# Altium schematic sheet HALF_BRIDGE_DRIVER.SchDoc
size 420 x 297 mm; SheetNumber: 22; SheetTotal: 27
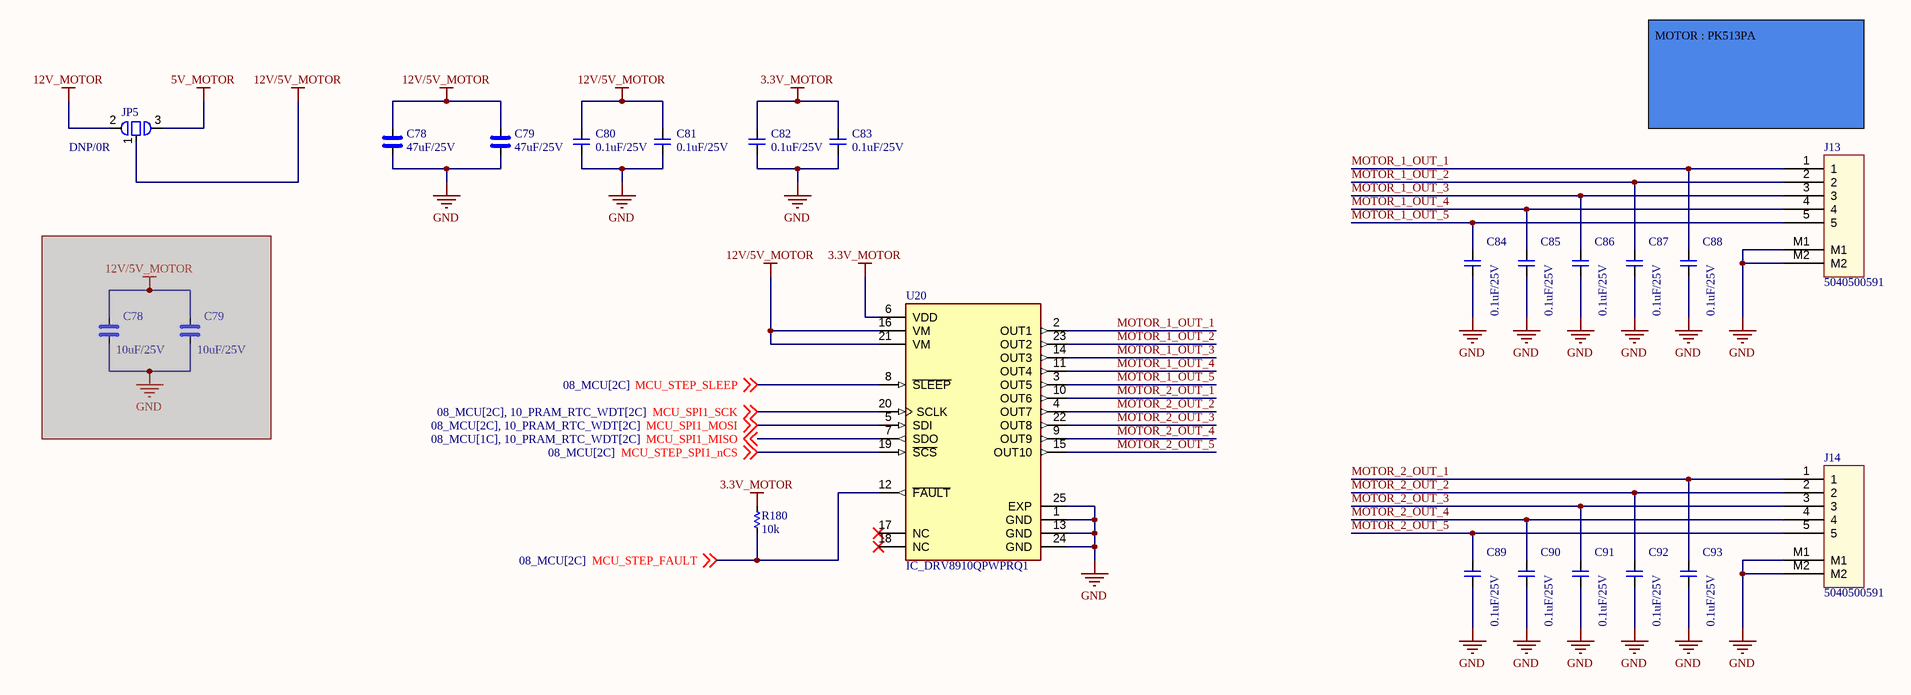
[diagram p0: HALF_BRIDGE_DRIVER.SchDoc]

## Parts
(Parts that share a designator on the sheet are numbered #1, #2 ... from top to bottom, then left to right.)
C78#1  47uF/25V  [CAP_C_3225X80]
C78#2  10uF/25V  [CAP_C_2012X110]  (masked out: inside a compile mask, not in the netlist)
C79#1  47uF/25V  [CAP_C_3225X80]
C79#2  10uF/25V  [CAP_C_2012X110]  (masked out: inside a compile mask, not in the netlist)
C80  0.1uF/25V  [CAP_C_1608X80]
C81  0.1uF/25V  [CAP_C_1608X80]
C82  0.1uF/25V  [CAP_C_1608X80]
C83  0.1uF/25V  [CAP_C_1608X80]
C84  0.1uF/25V  [CAP_C_1608X80]
C85  0.1uF/25V  [CAP_C_1608X80]
C86  0.1uF/25V  [CAP_C_1608X80]
C87  0.1uF/25V  [CAP_C_1608X80]
C88  0.1uF/25V  [CAP_C_1608X80]
C89  0.1uF/25V  [CAP_C_1608X80]
C90  0.1uF/25V  [CAP_C_1608X80]
C91  0.1uF/25V  [CAP_C_1608X80]
C92  0.1uF/25V  [CAP_C_1608X80]
C93  0.1uF/25V  [CAP_C_1608X80]
J13  5040500591  [MOLEX_5040500591]
J14  5040500591  [MOLEX_5040500591]
JP5  DNP/0R  [JUMPER_1-2_1608X60]
R180  10k  [RES_C_1005X40]
U20  IC_DRV8910QPWPRQ1  [IC_DRV8910QPWPRQ1]

## Nets
3.3V_MOTOR: C82.2 C83.2 R180.2 U20.6(VDD)
5V_MOTOR: JP5.3
12V/5V_MOTOR: C78#1.2 C79#1.2 C80.2 C81.2 JP5.1 U20.16(VM) U20.21(VM)
12V_MOTOR: JP5.2
GND: C78#1.1 C79#1.1 C80.1 C81.1 C82.1 C83.1 C84.1 C85.1 C86.1 C87.1 C88.1 C89.1 C90.1 C91.1 C92.1 C93.1 J13.M1 J13.M2 J14.M1 J14.M2 U20.1(GND) U20.13(GND) U20.24(GND) U20.25(EXP)
MCU_SPI1_MISO: U20.7(SDO) ; off-sheet MCU_SPI1_MISO
MCU_SPI1_MOSI: U20.5(SDI) ; off-sheet MCU_SPI1_MOSI
MCU_SPI1_SCK: U20.20(SCLK) ; off-sheet MCU_SPI1_SCK
MCU_STEP_FAULT: R180.1 U20.12(~{FAULT}) ; off-sheet MCU_STEP_FAULT
MCU_STEP_SLEEP: U20.8(~{SLEEP}) ; off-sheet MCU_STEP_SLEEP
MCU_STEP_SPI1_nCS: U20.19(~{SCS}) ; off-sheet MCU_STEP_SPI1_nCS
MOTOR_1_OUT_1: C88.2 J13.1 U20.2(OUT1)
MOTOR_1_OUT_2: C87.2 J13.2 U20.23(OUT2)
MOTOR_1_OUT_3: C86.2 J13.3 U20.14(OUT3)
MOTOR_1_OUT_4: C85.2 J13.4 U20.11(OUT4)
MOTOR_1_OUT_5: C84.2 J13.5 U20.3(OUT5)
MOTOR_2_OUT_1: C93.2 J14.1 U20.10(OUT6)
MOTOR_2_OUT_2: C92.2 J14.2 U20.4(OUT7)
MOTOR_2_OUT_3: C91.2 J14.3 U20.22(OUT8)
MOTOR_2_OUT_4: C90.2 J14.4 U20.9(OUT9)
MOTOR_2_OUT_5: C89.2 J14.5 U20.15(OUT10)

Not connected (* = marked no-connect by the designer): U20 17(NC)* 18(NC)*

## Notes on the sheet
- (near J13) MOTOR : PK513PA
- Project
- Sub-system:
- Design by:
- Sheet title:
- Sheet:
- of
- Checked by:
- Approved by:
- Doc no:
- Revision
- Size:
- Date:

## Library data of the parts
C78#1 C78#2 C79#1 C79#2 = _CAP_C_High_2: CAP High Value
C80-C93 = _CAP_C_2: CAP
J13 J14 = Header 5x1_2M
JP5 = JUMPER_1_2
R180 = _RES_B_2: RES
U20 = IC_DRV8910QPWPRQ1: Automotive, 40-V, 6-A, 10-channel half-bridge motor driver with advanced diagnostics; MF: Texas Instruments; Package: HTSSOP-24 Texas Instruments; Price: None; Check_prices: https://www.snapeda.com/parts/DRV8910QPWPRQ1/Texas+Instruments/view-part/?ref=eda; Value: *; SnapEDA_Link: https://www.snapeda.com/parts/DRV8910QPWPRQ1/Texas+Instruments/view-part/?ref=snap; MP: DRV8910QPWPRQ1; Availability: In Stock; Purchase-URL: https://pricing.snapeda.com/search?q=DRV8910QPWPRQ1&ref=eda